# Altium project Horizontal New MC.PrjPcb
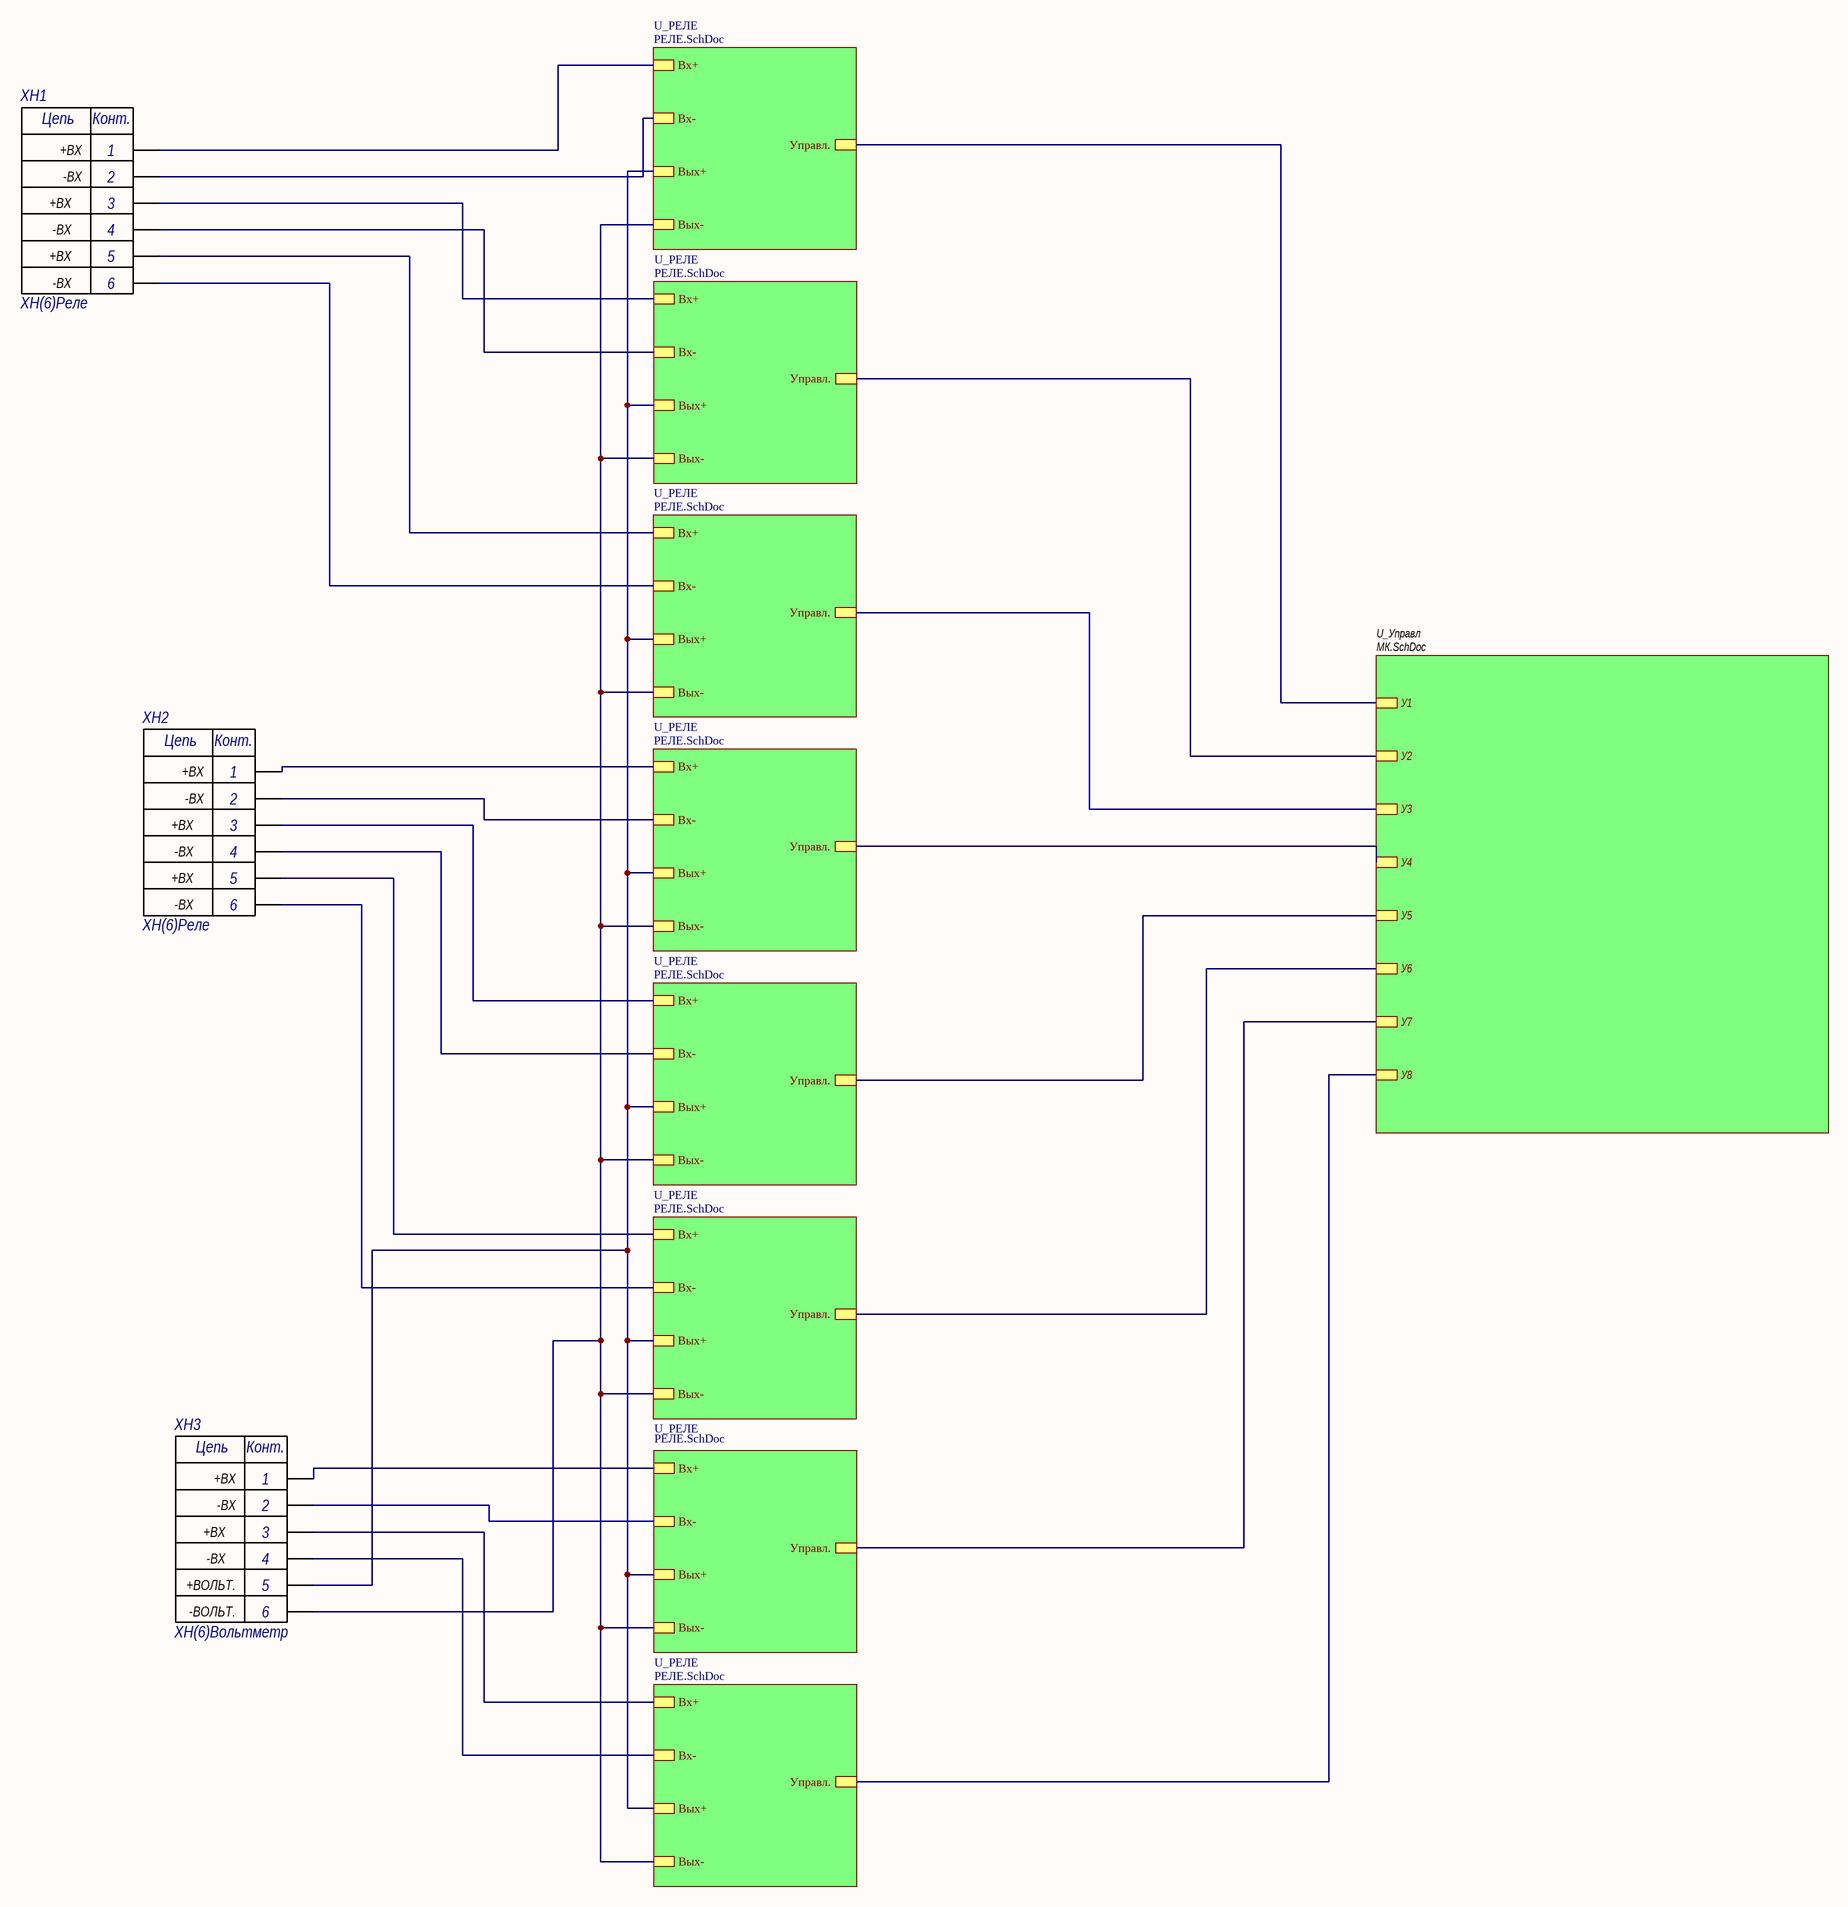
[diagram p0: СОЕД.SchDoc]
5 sheets, 175 parts. Net scope: hierarchical (ports join the sheet entries above them; power ports are global).
Board file: Horizontal Circuit Board.PcbDoc
Sheets:
  СОЕД.SchDoc
    U_РЕЛЕ = РЕЛЕ.SchDoc
    U_Управл = МК.SchDoc
      Y_СОГЛАСОВАНИЕ = СОГЛАСОВАНИЕ с мюксами.SchDoc
        Designator = ВХ Б (1-6).SchDoc
        Designator = ВХ Б (1-6).SchDoc
        Designator = ВХ Б (1-6).SchDoc
        Designator = ВХ Б (1-6).SchDoc
        Designator = ВХ Б (1-6).SchDoc
        Designator = ВХ Б (1-6).SchDoc
    U_РЕЛЕ = РЕЛЕ.SchDoc
    U_РЕЛЕ = РЕЛЕ.SchDoc
    U_РЕЛЕ = РЕЛЕ.SchDoc
    U_РЕЛЕ = РЕЛЕ.SchDoc
    U_РЕЛЕ = РЕЛЕ.SchDoc
    U_РЕЛЕ = РЕЛЕ.SchDoc
    U_РЕЛЕ = РЕЛЕ.SchDoc

## Sheet СОЕД.SchDoc
size A2; Organization: Altium Limited; Address1: L3, 12a Rodborough Rd; Address2: Frenchs Forest; Address3: NSW; Address4: Australia 2086; SheetNumber: 1; SheetTotal: 5

### Parts
XH1  ХH(6)Реле  [XH(6)]
XH2  ХH(6)Реле  [XH(6)]
XH3  ХH(6)Вольтметр  [XH(6)]

### Sub-sheets
U_РЕЛЕ = РЕЛЕ.SchDoc: Управл., Вх+, Вх-, Вых-, Вых+
U_РЕЛЕ = РЕЛЕ.SchDoc: Управл., Вх+, Вх-, Вых-, Вых+
U_РЕЛЕ = РЕЛЕ.SchDoc: Управл., Вх+, Вх-, Вых-, Вых+
U_РЕЛЕ = РЕЛЕ.SchDoc: Управл., Вх+, Вх-, Вых-, Вых+
U_РЕЛЕ = РЕЛЕ.SchDoc: Управл., Вх+, Вх-, Вых-, Вых+
U_РЕЛЕ = РЕЛЕ.SchDoc: Управл., Вх+, Вх-, Вых-, Вых+
U_РЕЛЕ = РЕЛЕ.SchDoc: Управл., Вх+, Вх-, Вых-, Вых+
U_РЕЛЕ = РЕЛЕ.SchDoc: Управл., Вх+, Вх-, Вых-, Вых+
U_Управл = МК.SchDoc: У8, У7, У2, У6, У5, У3, У1, У4

### Nets
NetDD1_24: sheet U_РЕЛЕ/Управл., sheet U_Управл/У1
NetDD1_25: sheet U_Управл/У2, sheet U_РЕЛЕ/Управл.
NetDD1_26: sheet U_Управл/У3, sheet U_РЕЛЕ/Управл.
NetDD1_29: sheet U_Управл/У4, sheet U_РЕЛЕ/Управл.
NetDD1_30: sheet U_Управл/У5, sheet U_РЕЛЕ/Управл.
NetDD1_31: sheet U_Управл/У6, sheet U_РЕЛЕ/Управл.
NetDD1_32: sheet U_Управл/У7, sheet U_РЕЛЕ/Управл.
NetDD1_67: sheet U_Управл/У8, sheet U_РЕЛЕ/Управл.
NetK1_U_РЕЛЕ#1_3: XH1.2(-ВХ) ; sheet U_РЕЛЕ/Вх-
NetK1_U_РЕЛЕ#1_4: XH3.6(-ВОЛЬТ.) ; sheet U_РЕЛЕ/Вых-, sheet U_РЕЛЕ/Вых-, sheet U_РЕЛЕ/Вых-, sheet U_РЕЛЕ/Вых-, sheet U_РЕЛЕ/Вых-, sheet U_РЕЛЕ/Вых-, sheet U_РЕЛЕ/Вых-, sheet U_РЕЛЕ/Вых-
NetK1_U_РЕЛЕ#1_5: XH3.5(+ВОЛЬТ.) ; sheet U_РЕЛЕ/Вых+, sheet U_РЕЛЕ/Вых+, sheet U_РЕЛЕ/Вых+, sheet U_РЕЛЕ/Вых+, sheet U_РЕЛЕ/Вых+, sheet U_РЕЛЕ/Вых+, sheet U_РЕЛЕ/Вых+, sheet U_РЕЛЕ/Вых+
NetK1_U_РЕЛЕ#1_6: XH1.1(+ВХ) ; sheet U_РЕЛЕ/Вх+
NetK1_U_РЕЛЕ#2_3: XH1.4(-ВХ) ; sheet U_РЕЛЕ/Вх-
NetK1_U_РЕЛЕ#2_6: XH1.3(+ВХ) ; sheet U_РЕЛЕ/Вх+
NetK1_U_РЕЛЕ#3_3: XH1.6(-ВХ) ; sheet U_РЕЛЕ/Вх-
NetK1_U_РЕЛЕ#3_6: XH1.5(+ВХ) ; sheet U_РЕЛЕ/Вх+
NetK1_U_РЕЛЕ#4_3: XH2.2(-ВХ) ; sheet U_РЕЛЕ/Вх-
NetK1_U_РЕЛЕ#4_6: XH2.1(+ВХ) ; sheet U_РЕЛЕ/Вх+
NetK1_U_РЕЛЕ#5_3: XH2.4(-ВХ) ; sheet U_РЕЛЕ/Вх-
NetK1_U_РЕЛЕ#5_6: XH2.3(+ВХ) ; sheet U_РЕЛЕ/Вх+
NetK1_U_РЕЛЕ#6_3: XH2.6(-ВХ) ; sheet U_РЕЛЕ/Вх-
NetK1_U_РЕЛЕ#6_6: XH2.5(+ВХ) ; sheet U_РЕЛЕ/Вх+
NetK1_U_РЕЛЕ#7_3: XH3.2(-ВХ) ; sheet U_РЕЛЕ/Вх-
NetK1_U_РЕЛЕ#7_6: XH3.1(+ВХ) ; sheet U_РЕЛЕ/Вх+
NetK1_U_РЕЛЕ#8_3: XH3.4(-ВХ) ; sheet U_РЕЛЕ/Вх-
NetK1_U_РЕЛЕ#8_6: XH3.3(+ВХ) ; sheet U_РЕЛЕ/Вх+

### Notes on the sheet
- Title
- Size:
- Date:
- File:
- A2
- Number:
- Time:
- Revision:
- Sheet
- of
- (in symbol ХH(6)Вольтметр) Цепь; Конт.
- (in symbol ХH(6)Реле) Цепь; Конт.

## Sheet РЕЛЕ.SchDoc
size A4; Organization: Altium Limited; Address1: L3, 12a Rodborough Rd; Address2: Frenchs Forest; Address3: NSW; Address4: Australia 2086; SheetNumber: 5; SheetTotal: 5
Used 8 times, as channels U_РЕЛЕ, U_РЕЛЕ, U_РЕЛЕ, U_РЕЛЕ, U_РЕЛЕ, U_РЕЛЕ, U_РЕЛЕ, U_РЕЛЕ. Parts and nets are listed once, with the designators drawn on the sheet.
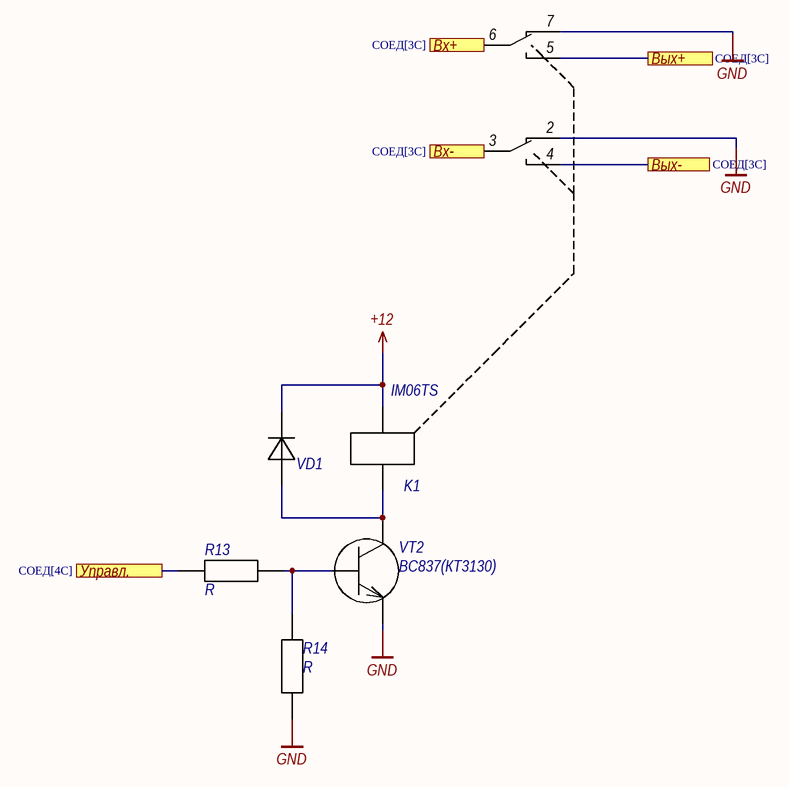
[diagram p1: РЕЛЕ.SchDoc]

### Parts
K1  IM06TS  [IM06TS]
R13  R  [R]
R14  R  [R]
VD1  SS14  [SS14]  (value not drawn)
VT2  BC837(КТ3130)  [BC847(IRLML6402)]

### Ports
Вх+ (see СОЕД[3C]), Вх- (see СОЕД[3C]), Вых+ (see СОЕД[3C]), Вых- (see СОЕД[3C]), Управл. (see СОЕД[4C])

### Nets
+12: K1.1 VD1.1
GND: K1.2 K1.7 R14.1 VT2.2
Вх+: K1.6 ; port Вх+
Вх-: K1.3 ; port Вх-
Вых+: K1.5 ; port Вых+
Вых-: K1.4 ; port Вых-
Управл.: R13.1 ; port Управл.
NetK1_8: K1.8 VD1.2 VT2.3
NetR13_2: R13.2 R14.2 VT2.1

### Channels
U_РЕЛЕ: designators end in _U_РЕЛЕ#1; ports Вх+=NetK1_U_РЕЛЕ#1_6 Вх-=NetK1_U_РЕЛЕ#1_3 Вых+=NetK1_U_РЕЛЕ#1_5 Вых-=NetK1_U_РЕЛЕ#1_4 Управл.=NetDD1_24
U_РЕЛЕ: designators end in _U_РЕЛЕ#2; ports Вх+=NetK1_U_РЕЛЕ#2_6 Вх-=NetK1_U_РЕЛЕ#2_3 Вых+=NetK1_U_РЕЛЕ#1_5 Вых-=NetK1_U_РЕЛЕ#1_4 Управл.=NetDD1_25
U_РЕЛЕ: designators end in _U_РЕЛЕ#3; ports Вх+=NetK1_U_РЕЛЕ#3_6 Вх-=NetK1_U_РЕЛЕ#3_3 Вых+=NetK1_U_РЕЛЕ#1_5 Вых-=NetK1_U_РЕЛЕ#1_4 Управл.=NetDD1_26
U_РЕЛЕ: designators end in _U_РЕЛЕ#4; ports Вх+=NetK1_U_РЕЛЕ#4_6 Вх-=NetK1_U_РЕЛЕ#4_3 Вых+=NetK1_U_РЕЛЕ#1_5 Вых-=NetK1_U_РЕЛЕ#1_4 Управл.=NetDD1_29
U_РЕЛЕ: designators end in _U_РЕЛЕ#5; ports Вх+=NetK1_U_РЕЛЕ#5_6 Вх-=NetK1_U_РЕЛЕ#5_3 Вых+=NetK1_U_РЕЛЕ#1_5 Вых-=NetK1_U_РЕЛЕ#1_4 Управл.=NetDD1_30
U_РЕЛЕ: designators end in _U_РЕЛЕ#6; ports Вх+=NetK1_U_РЕЛЕ#6_6 Вх-=NetK1_U_РЕЛЕ#6_3 Вых+=NetK1_U_РЕЛЕ#1_5 Вых-=NetK1_U_РЕЛЕ#1_4 Управл.=NetDD1_31
U_РЕЛЕ: designators end in _U_РЕЛЕ#7; ports Вх+=NetK1_U_РЕЛЕ#7_6 Вх-=NetK1_U_РЕЛЕ#7_3 Вых+=NetK1_U_РЕЛЕ#1_5 Вых-=NetK1_U_РЕЛЕ#1_4 Управл.=NetDD1_32
U_РЕЛЕ: designators end in _U_РЕЛЕ#8; ports Вх+=NetK1_U_РЕЛЕ#8_6 Вх-=NetK1_U_РЕЛЕ#8_3 Вых+=NetK1_U_РЕЛЕ#1_5 Вых-=NetK1_U_РЕЛЕ#1_4 Управл.=NetDD1_67

### Notes on the sheet
- Title
- Size:
- Date:
- A4
- Number:
- Time:
- Revision:
- Sheet
- of
- File:

### Library data of the parts
VT2 = BC837(КТ3130): Транзистор

## Sheet МК.SchDoc
size 840 x 594 mm; SheetNumber: 2; SheetTotal: 5
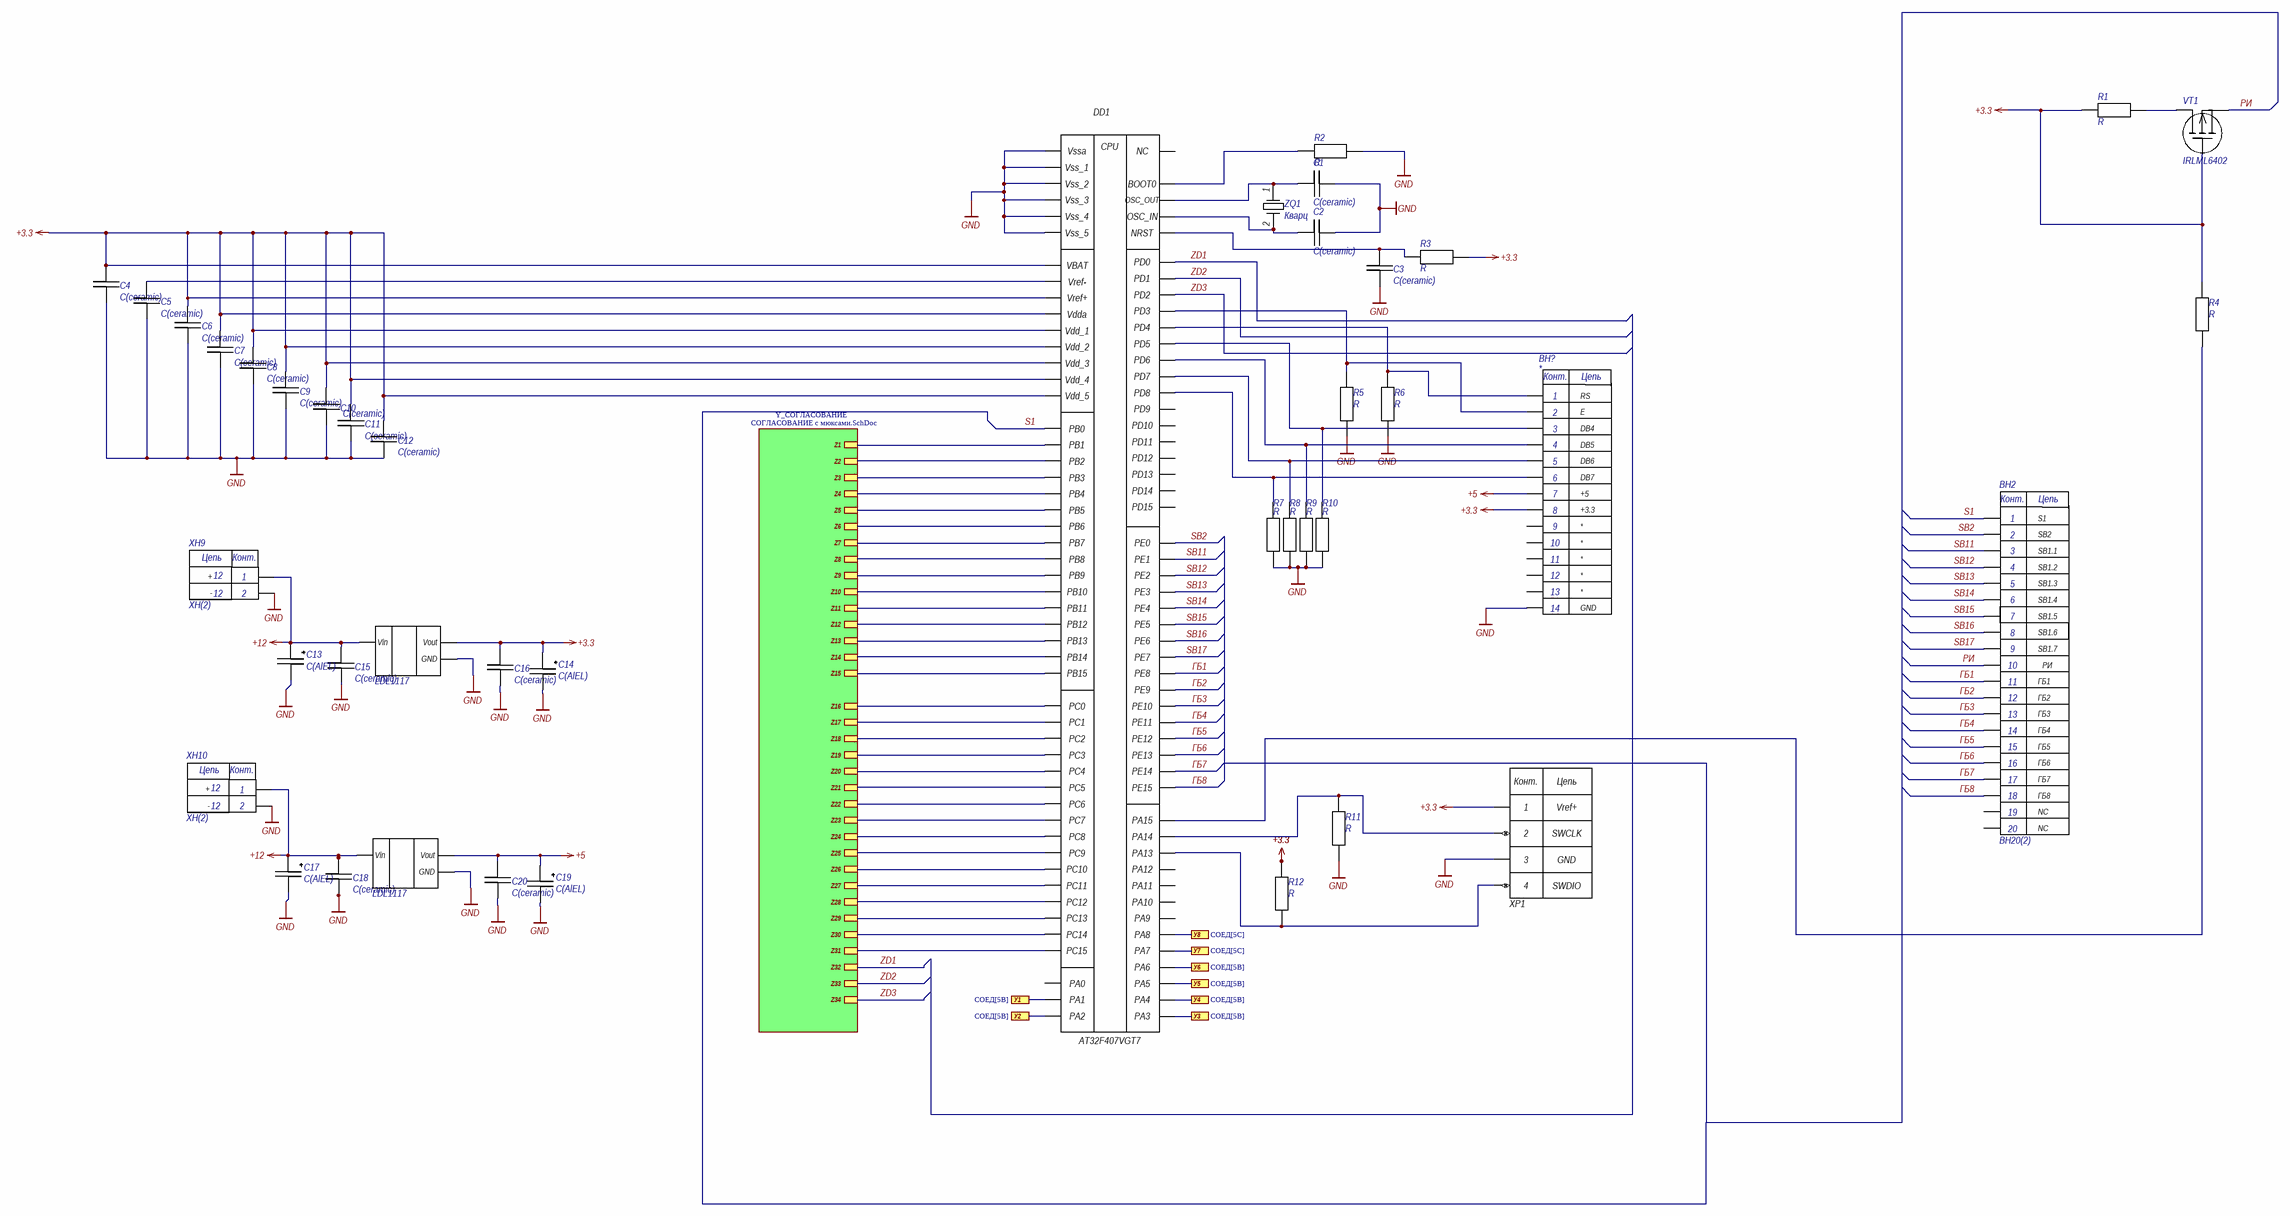
[diagram p2: МК.SchDoc]

### Parts
BH2  BH20(2)  [IDC20]
BH?  *  [BH-14 (DS1013-14S) (IDC-14MS)]
C1  C(ceramic)  [C(ceramic)]
C2  C(ceramic)  [C(ceramic)]
C3  C(ceramic)  [C(ceramic)]
C4  C(ceramic)  [C(ceramic)]
C5  C(ceramic)  [C(ceramic)]
C6  C(ceramic)  [C(ceramic)]
C7  C(ceramic)  [C(ceramic)]
C8  C(ceramic)  [C(ceramic)]
C9  C(ceramic)  [C(ceramic)]
C10  C(ceramic)  [C(ceramic)]
C11  C(ceramic)  [C(ceramic)]
C12  C(ceramic)  [C(ceramic)]
C13  C(AlEL)  [C(AlEL)]
C14  C(AlEL)  [C(AlEL)]
C15  C(ceramic)  [C(ceramic)]
C16  C(ceramic)  [C(ceramic)]
C17  C(AlEL)  [C(AlEL)]
C18  C(ceramic)  [C(ceramic)]
C19  C(AlEL)  [C(AlEL)]
C20  C(ceramic)  [C(ceramic)]
DD1  AT32F407VGT7  [Микроконтроллер AT32F407VGT7_LQFP-100]
DD2  LDL1117  [LDL1117]
DD3  LDL1117  [LDL1117]
R1  R  [R]
R2  R  [R]
R3  R  [R]
R4  R  [R]
R5  R  [R]
R6  R  [R]
R7  R  [R]
R8  R  [R]
R9  R  [R]
R10  R  [R]
R11  R  [R]
R12  R  [R]
VT1  IRLML6402  [BC847(IRLML6402)]
XH9  ХН(2)  [ХН(2)]
XH10  ХН(2)  [ХН(2)]
XP1  Обозначение при заказе  [PLS-4]  (value not drawn)
ZQ1  Кварц  [KX-38 32.768 KHZ]

### Sub-sheets
Y_СОГЛАСОВАНИЕ = СОГЛАСОВАНИЕ с мюксами.SchDoc: Z1, Z2, Z3, Z4, Z5, Z6, Z7, Z8, Z9, Z10, Z11, Z12, Z13, Z14, Z15, Z16, Z17, Z18, Z19, Z20, Z21, Z22, Z23, Z24, Z25, Z26, Z27, Z28, Z29, Z30, Z31, Z32, Z33, Z34

### Ports
У1 (see СОЕД[5B]), У2 (see СОЕД[5B]), У3 (see СОЕД[5B]), У4 (see СОЕД[5B]), У5 (see СОЕД[5B]), У6 (see СОЕД[5B]), У7 (see СОЕД[5C]), У8 (see СОЕД[5C])

### Nets
+3.3: BH?.8(+3.3) C4.2 C6.2 C7.2 C8.2 C9.2 C10.2 C11.2 C12.2 C14.1 C16.2 DD1.6(VBAT) DD1.11(Vdd_5) DD1.21(Vref+) DD1.22(Vdda) DD1.28(Vdd_4) DD1.50(Vdd_1) DD1.75(Vdd_2) DD1.100(Vdd_3) DD2.2(Vout) R1.2 R3.1 R4.2 R12.1 VT1.1 XP1.1(Uпит)
+5: BH?.7(+5) C19.1 C20.2 DD3.2(Vout)
+12: C13.1 C15.2 C17.1 C18.2 DD2.3(Vin) DD3.3(Vin) XH9.1(+) XH10.1(+)
GND: BH?.14(GND) C1.2 C2.2 C3.1 C4.1 C5.1 C6.1 C7.1 C8.1 C9.1 C10.1 C11.1 C12.1 C13.2 C14.2 C15.1 C16.1 C17.2 C18.1 C19.2 C20.1 DD1.10(Vss_5) DD1.19(Vssa) DD1.27(Vss_4) DD1.49(Vss_1) DD1.74(Vss_2) DD1.99(Vss_3) DD2.1(GND) DD3.1(GND) R2.2 R5.1 R6.1 R7.2 R8.2 R9.2 R10.2 R11.1 XH9.2(-) XH10.2(-) XP1.3(GND)
S1: BH2.1(S1) DD1.35(PB0)
SB2: BH2.2(SB2) DD1.97(PE0)
SB11: BH2.3(SB1.1) DD1.98(PE1)
SB12: BH2.4(SB1.2) DD1.1(PE2)
SB13: BH2.5(SB1.3) DD1.2(PE3)
SB14: BH2.6(SB1.4) DD1.3(PE4)
SB15: BH2.7(SB1.5) DD1.4(PE5)
SB16: BH2.8(SB1.6) DD1.5(PE6)
SB17: BH2.9(SB1.7) DD1.38(PE7)
ZD1: DD1.81(PD0) ; sheet Y_СОГЛАСОВАНИЕ/Z32
ZD2: DD1.82(PD1) ; sheet Y_СОГЛАСОВАНИЕ/Z33
ZD3: DD1.83(PD2) ; sheet Y_СОГЛАСОВАНИЕ/Z34
ГБ1: BH2.11(ГБ1) DD1.39(PE8)
ГБ2: BH2.12(ГБ2) DD1.40(PE9)
ГБ3: BH2.13(ГБ3) DD1.41(PE10)
ГБ4: BH2.14(ГБ4) DD1.42(PE11)
ГБ5: BH2.15(ГБ5) DD1.43(PE12)
ГБ6: BH2.16(ГБ6) DD1.44(PE13)
ГБ7: BH2.17(ГБ7) DD1.45(PE14)
ГБ8: BH2.18(ГБ8) DD1.46(PE15)
РИ: BH2.10(РИ) VT1.2
NetBH?_1: BH?.1(RS) DD1.85(PD4) R6.2
NetBH?_2: BH?.2(E) DD1.84(PD3) R5.2
NetBH?_3: BH?.3(DB4) DD1.86(PD5) R10.1
NetBH?_4: BH?.4(DB5) DD1.87(PD6) R9.1
NetBH?_5: BH?.5(DB6) DD1.88(PD7) R8.1
NetBH?_6: BH?.6(DB7) DD1.55(PD8) R7.1
NetC1_1: C1.1 DD1.13(OSC_OUT) ZQ1.1
NetC2_1: C2.1 DD1.12(OSC_IN) ZQ1.2
NetC3_2: C3.2 DD1.14(NRST) R3.2
NetC5_2: C5.2 DD1.20(Vref-)
NetDD1_7: DD1.7(PC13) ; sheet Y_СОГЛАСОВАНИЕ/Z29
NetDD1_8: DD1.8(PC14) ; sheet Y_СОГЛАСОВАНИЕ/Z30
NetDD1_9: DD1.9(PC15) ; sheet Y_СОГЛАСОВАНИЕ/Z31
NetDD1_15: DD1.15(PC0) ; sheet Y_СОГЛАСОВАНИЕ/Z16
NetDD1_16: DD1.16(PC1) ; sheet Y_СОГЛАСОВАНИЕ/Z17
NetDD1_17: DD1.17(PC2) ; sheet Y_СОГЛАСОВАНИЕ/Z18
NetDD1_18: DD1.18(PC3) ; sheet Y_СОГЛАСОВАНИЕ/Z19
NetDD1_24: DD1.24(PA1) ; port У1
NetDD1_25: DD1.25(PA2) ; port У2
NetDD1_26: DD1.26(PA3) ; port У3
NetDD1_29: DD1.29(PA4) ; port У4
NetDD1_30: DD1.30(PA5) ; port У5
NetDD1_31: DD1.31(PA6) ; port У6
NetDD1_32: DD1.32(PA7) ; port У7
NetDD1_33: DD1.33(PC4) ; sheet Y_СОГЛАСОВАНИЕ/Z20
NetDD1_34: DD1.34(PC4) ; sheet Y_СОГЛАСОВАНИЕ/Z21
NetDD1_36: DD1.36(PB1) ; sheet Y_СОГЛАСОВАНИЕ/Z1
NetDD1_37: DD1.37(PB2) ; sheet Y_СОГЛАСОВАНИЕ/Z2
NetDD1_47: DD1.47(PB10) ; sheet Y_СОГЛАСОВАНИЕ/Z10
NetDD1_48: DD1.48(PB11) ; sheet Y_СОГЛАСОВАНИЕ/Z11
NetDD1_51: DD1.51(PB12) ; sheet Y_СОГЛАСОВАНИЕ/Z12
NetDD1_52: DD1.52(PB13) ; sheet Y_СОГЛАСОВАНИЕ/Z13
NetDD1_53: DD1.53(PB14) ; sheet Y_СОГЛАСОВАНИЕ/Z14
NetDD1_54: DD1.54(PB15) ; sheet Y_СОГЛАСОВАНИЕ/Z15
NetDD1_63: DD1.63(PC6) ; sheet Y_СОГЛАСОВАНИЕ/Z22
NetDD1_64: DD1.64(PC7) ; sheet Y_СОГЛАСОВАНИЕ/Z23
NetDD1_65: DD1.65(PC8) ; sheet Y_СОГЛАСОВАНИЕ/Z24
NetDD1_66: DD1.66(PC9) ; sheet Y_СОГЛАСОВАНИЕ/Z25
NetDD1_67: DD1.67(PA8) ; port У8
NetDD1_72: DD1.72(PA13) R12.2 XP1.4(SWDIO)
NetDD1_76: DD1.76(PA14) R11.2 XP1.2(SWCLK)
NetDD1_77: DD1.77(PA15) R4.1
NetDD1_78: DD1.78(PC10) ; sheet Y_СОГЛАСОВАНИЕ/Z26
NetDD1_79: DD1.79(PC11) ; sheet Y_СОГЛАСОВАНИЕ/Z27
NetDD1_80: DD1.80(PC12) ; sheet Y_СОГЛАСОВАНИЕ/Z28
NetDD1_89: DD1.89(PB3) ; sheet Y_СОГЛАСОВАНИЕ/Z3
NetDD1_90: DD1.90(PB4) ; sheet Y_СОГЛАСОВАНИЕ/Z4
NetDD1_91: DD1.91(PB5) ; sheet Y_СОГЛАСОВАНИЕ/Z5
NetDD1_92: DD1.92(PB6) ; sheet Y_СОГЛАСОВАНИЕ/Z6
NetDD1_93: DD1.93(PB7) ; sheet Y_СОГЛАСОВАНИЕ/Z7
NetDD1_94: DD1.94(BOOT0) R2.1
NetDD1_95: DD1.95(PB8) ; sheet Y_СОГЛАСОВАНИЕ/Z8
NetDD1_96: DD1.96(PB9) ; sheet Y_СОГЛАСОВАНИЕ/Z9
NetR1_1: R1.1 VT1.3

Not connected (* = marked no-connect by the designer): BH2 19(NC) 20(NC); BH? 9(*) 10(*) 11(*) 12(*) 13(*); DD1 23(PA0) 56(PD9) 57(PD10) 58(PD11) 59(PD12) 60(PD13) 61(PD14) 62(PD15) 68(PA9) 69(PA10) 70(PA11) 71(PA12) 73(NC)

### Notes on the sheet
- 12
- Перв. примен.
- Справ. №
- Подп. дата
- Инв. № дубл.
- Взам. инв. №
- Подп. и дата
- Изм.
- Разраб.
- Лист
- № докум.
- Подп.
- Дата
- Лит.
- Масса
- Масштаб
- Пров.
- Т.контр.
- Листов
- Инв. № подл.
- Н.контр.
- Утв.
- ALTIUM GOSTBOM2.0 KEV
- Файл:
- Копировал
- Формат А1
- (in symbol AT32F407) CPU; PC5
- (in symbol BH14(3)) Конт.; Цепь
- (in symbol BH20(2)) Конт.; Цепь
- (in symbol PLS-4) Конт.; Цепь; Vref+
- (in symbol ХН(2)) Цепь; Конт.

### Library data of the parts
BH? = BH14(3)
C1-C12 C15 C16 C18 C20 = C(ceramic): SMD
C13 C14 C17 C19 = C(AlEL): Электролит
DD1 = AT32F407: МК
DD2 DD3 = LDL1117: Стабилизатор
R1-R12 = R: SMD
VT1 = IRLML6402: Транзистор
XP1 = PLS-4: Штырьки
ZQ1 = KX-38 32.768 KHZ

## Sheet СОГЛАСОВАНИЕ с мюксами.SchDoc
size 297 x 420 mm; Organization: Altium Limited; Address1: L3, 12a Rodborough Rd; Address2: Frenchs Forest; Address3: NSW; Address4: Australia 2086; SheetNumber: 3; SheetTotal: 5
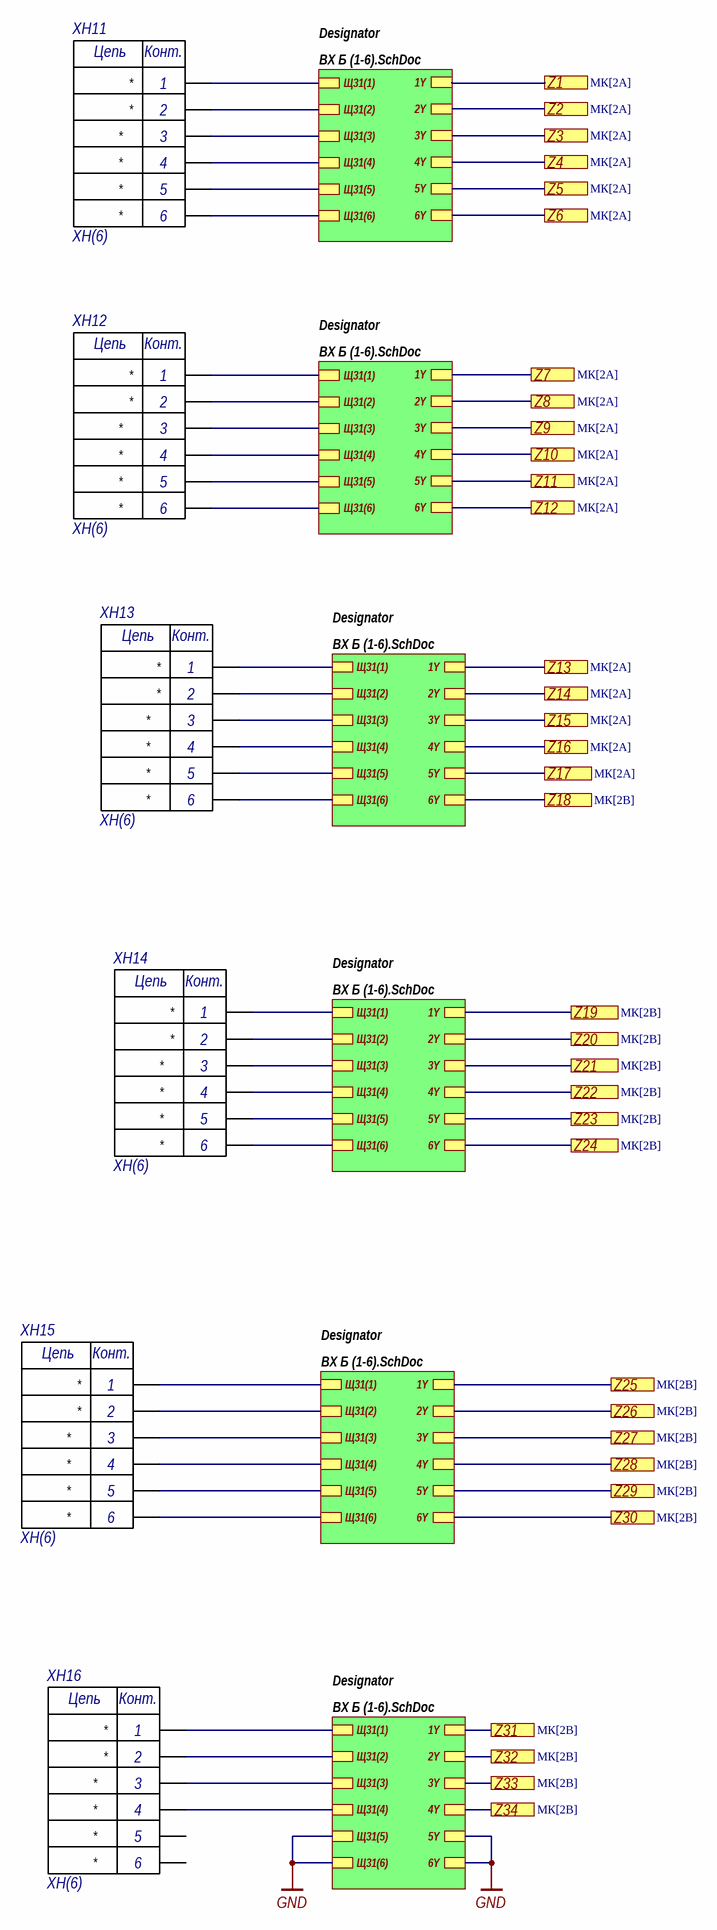
[diagram p3: СОГЛАСОВАНИЕ с мюксами.SchDoc]

### Parts
XH11  ХH(6)  [XH(6)]
XH12  ХH(6)  [XH(6)]
XH13  ХH(6)  [XH(6)]
XH14  ХH(6)  [XH(6)]
XH15  ХH(6)  [XH(6)]
XH16  ХH(6)  [XH(6)]

### Sub-sheets
Designator = ВХ Б (1-6).SchDoc: Щ31(1), Щ31(2), Щ31(3), Щ31(4), 2Y, 3Y, 4Y, 5Y, 6Y, Щ31(5), Щ31(6), 1Y
Designator = ВХ Б (1-6).SchDoc: Щ31(1), Щ31(2), Щ31(3), Щ31(4), 2Y, 3Y, 4Y, 5Y, 6Y, Щ31(5), Щ31(6), 1Y
Designator = ВХ Б (1-6).SchDoc: Щ31(1), Щ31(2), Щ31(3), Щ31(4), 2Y, 3Y, 4Y, 5Y, 6Y, Щ31(5), Щ31(6), 1Y
Designator = ВХ Б (1-6).SchDoc: Щ31(1), Щ31(2), Щ31(3), Щ31(4), 2Y, 3Y, 4Y, 5Y, 6Y, Щ31(5), Щ31(6), 1Y
Designator = ВХ Б (1-6).SchDoc: Щ31(1), Щ31(2), Щ31(3), Щ31(4), 2Y, 3Y, 4Y, 5Y, 6Y, Щ31(5), Щ31(6), 1Y
Designator = ВХ Б (1-6).SchDoc: Щ31(1), Щ31(2), Щ31(3), Щ31(4), 2Y, 3Y, 4Y, 5Y, 6Y, Щ31(5), Щ31(6), 1Y

### Ports
Z1 (see МК[2A]), Z2 (see МК[2A]), Z3 (see МК[2A]), Z4 (see МК[2A]), Z5 (see МК[2A]), Z6 (see МК[2A]), Z7 (see МК[2A]), Z8 (see МК[2A]), Z9 (see МК[2A]), Z10 (see МК[2A]), Z11 (see МК[2A]), Z12 (see МК[2A]), Z13 (see МК[2A]), Z14 (see МК[2A]), Z15 (see МК[2A]), Z16 (see МК[2A]), Z17 (see МК[2A]), Z18 (see МК[2B]), Z19 (see МК[2B]), Z20 (see МК[2B]), Z21 (see МК[2B]), Z22 (see МК[2B]), Z23 (see МК[2B]), Z24 (see МК[2B]), Z25 (see МК[2B]), Z26 (see МК[2B]), Z27 (see МК[2B]), Z28 (see МК[2B]), Z29 (see МК[2B]), Z30 (see МК[2B]), Z31 (see МК[2B]), Z32 (see МК[2B]), Z33 (see МК[2B]), Z34 (see МК[2B])

### Nets
GND: sheet Designator/5Y, sheet Designator/6Y, sheet Designator/Щ31(5), sheet Designator/Щ31(6)
ZD1: port Z32, sheet Designator/2Y
ZD2: port Z33, sheet Designator/3Y
ZD3: port Z34, sheet Designator/4Y
NetDD1_7: port Z29, sheet Designator/5Y
NetDD1_8: port Z30, sheet Designator/6Y
NetDD1_9: port Z31, sheet Designator/1Y
NetDD1_15: port Z16, sheet Designator/4Y
NetDD1_16: port Z17, sheet Designator/5Y
NetDD1_17: port Z18, sheet Designator/6Y
NetDD1_18: port Z19, sheet Designator/1Y
NetDD1_33: port Z20, sheet Designator/2Y
NetDD1_34: port Z21, sheet Designator/3Y
NetDD1_36: port Z1, sheet Designator/1Y
NetDD1_37: port Z2, sheet Designator/2Y
NetDD1_47: port Z10, sheet Designator/4Y
NetDD1_48: port Z11, sheet Designator/5Y
NetDD1_51: port Z12, sheet Designator/6Y
NetDD1_52: port Z13, sheet Designator/1Y
NetDD1_53: port Z14, sheet Designator/2Y
NetDD1_54: port Z15, sheet Designator/3Y
NetDD1_63: port Z22, sheet Designator/4Y
NetDD1_64: port Z23, sheet Designator/5Y
NetDD1_65: port Z24, sheet Designator/6Y
NetDD1_66: port Z25, sheet Designator/1Y
NetDD1_78: port Z26, sheet Designator/2Y
NetDD1_79: port Z27, sheet Designator/3Y
NetDD1_80: port Z28, sheet Designator/4Y
NetDD1_89: port Z3, sheet Designator/3Y
NetDD1_90: port Z4, sheet Designator/4Y
NetDD1_91: port Z5, sheet Designator/5Y
NetDD1_92: port Z6, sheet Designator/6Y
NetDD1_93: port Z7, sheet Designator/1Y
NetDD1_95: port Z8, sheet Designator/2Y
NetDD1_96: port Z9, sheet Designator/3Y
NetR15_U_Управл_Y_СОГЛАСОВАНИЕ_Designator#1_1: XH11.1 ; sheet Designator/Щ31(1)
NetR15_U_Управл_Y_СОГЛАСОВАНИЕ_Designator#2_1: XH12.1 ; sheet Designator/Щ31(1)
NetR15_U_Управл_Y_СОГЛАСОВАНИЕ_Designator#3_1: XH13.1 ; sheet Designator/Щ31(1)
NetR15_U_Управл_Y_СОГЛАСОВАНИЕ_Designator#4_1: XH14.1 ; sheet Designator/Щ31(1)
NetR15_U_Управл_Y_СОГЛАСОВАНИЕ_Designator#5_1: XH15.1 ; sheet Designator/Щ31(1)
NetR15_U_Управл_Y_СОГЛАСОВАНИЕ_Designator#6_1: XH16.1 ; sheet Designator/Щ31(1)
NetR16_U_Управл_Y_СОГЛАСОВАНИЕ_Designator#1_1: XH11.2 ; sheet Designator/Щ31(2)
NetR16_U_Управл_Y_СОГЛАСОВАНИЕ_Designator#2_1: XH12.2 ; sheet Designator/Щ31(2)
NetR16_U_Управл_Y_СОГЛАСОВАНИЕ_Designator#3_1: XH13.2 ; sheet Designator/Щ31(2)
NetR16_U_Управл_Y_СОГЛАСОВАНИЕ_Designator#4_1: XH14.2 ; sheet Designator/Щ31(2)
NetR16_U_Управл_Y_СОГЛАСОВАНИЕ_Designator#5_1: XH15.2 ; sheet Designator/Щ31(2)
NetR16_U_Управл_Y_СОГЛАСОВАНИЕ_Designator#6_1: XH16.2 ; sheet Designator/Щ31(2)
NetR17_U_Управл_Y_СОГЛАСОВАНИЕ_Designator#1_1: XH11.3 ; sheet Designator/Щ31(3)
NetR17_U_Управл_Y_СОГЛАСОВАНИЕ_Designator#2_1: XH12.3 ; sheet Designator/Щ31(3)
NetR17_U_Управл_Y_СОГЛАСОВАНИЕ_Designator#3_1: XH13.3 ; sheet Designator/Щ31(3)
NetR17_U_Управл_Y_СОГЛАСОВАНИЕ_Designator#4_1: XH14.3 ; sheet Designator/Щ31(3)
NetR17_U_Управл_Y_СОГЛАСОВАНИЕ_Designator#5_1: XH15.3 ; sheet Designator/Щ31(3)
NetR17_U_Управл_Y_СОГЛАСОВАНИЕ_Designator#6_1: XH16.3 ; sheet Designator/Щ31(3)
NetR18_U_Управл_Y_СОГЛАСОВАНИЕ_Designator#1_1: XH11.4 ; sheet Designator/Щ31(4)
NetR18_U_Управл_Y_СОГЛАСОВАНИЕ_Designator#2_1: XH12.4 ; sheet Designator/Щ31(4)
NetR18_U_Управл_Y_СОГЛАСОВАНИЕ_Designator#3_1: XH13.4 ; sheet Designator/Щ31(4)
NetR18_U_Управл_Y_СОГЛАСОВАНИЕ_Designator#4_1: XH14.4 ; sheet Designator/Щ31(4)
NetR18_U_Управл_Y_СОГЛАСОВАНИЕ_Designator#5_1: XH15.4 ; sheet Designator/Щ31(4)
NetR18_U_Управл_Y_СОГЛАСОВАНИЕ_Designator#6_1: XH16.4 ; sheet Designator/Щ31(4)
NetR19_U_Управл_Y_СОГЛАСОВАНИЕ_Designator#1_1: XH11.5 ; sheet Designator/Щ31(5)
NetR19_U_Управл_Y_СОГЛАСОВАНИЕ_Designator#2_1: XH12.5 ; sheet Designator/Щ31(5)
NetR19_U_Управл_Y_СОГЛАСОВАНИЕ_Designator#3_1: XH13.5 ; sheet Designator/Щ31(5)
NetR19_U_Управл_Y_СОГЛАСОВАНИЕ_Designator#4_1: XH14.5 ; sheet Designator/Щ31(5)
NetR19_U_Управл_Y_СОГЛАСОВАНИЕ_Designator#5_1: XH15.5 ; sheet Designator/Щ31(5)
NetR20_U_Управл_Y_СОГЛАСОВАНИЕ_Designator#1_1: XH11.6 ; sheet Designator/Щ31(6)
NetR20_U_Управл_Y_СОГЛАСОВАНИЕ_Designator#2_1: XH12.6 ; sheet Designator/Щ31(6)
NetR20_U_Управл_Y_СОГЛАСОВАНИЕ_Designator#3_1: XH13.6 ; sheet Designator/Щ31(6)
NetR20_U_Управл_Y_СОГЛАСОВАНИЕ_Designator#4_1: XH14.6 ; sheet Designator/Щ31(6)
NetR20_U_Управл_Y_СОГЛАСОВАНИЕ_Designator#5_1: XH15.6 ; sheet Designator/Щ31(6)

Not connected (* = marked no-connect by the designer): XH16 5(*) 6(*)

### Notes on the sheet
- Подп. дата
- Инв. № дубл.
- Взам. инв. №
- Подп. и дата
- Инв. № подл.
- Изм.
- Лист
- № докум.
- Подп.
- Дата
- ALTIUM GOSTBOM2.0 KEV
- Файл:
- Копировал
- Формат А3
- (in symbol ХH(6)) Цепь; Конт.

## Sheet ВХ Б (1-6).SchDoc
size A3; Organization: Altium Limited; Address1: L3, 12a Rodborough Rd; Address2: Frenchs Forest; Address3: NSW; Address4: Australia 2086; SheetNumber: 4; SheetTotal: 5
Used 6 times, as channels U_Управл/Y_СОГЛАСОВАНИЕ/Designator, U_Управл/Y_СОГЛАСОВАНИЕ/Designator, U_Управл/Y_СОГЛАСОВАНИЕ/Designator, U_Управл/Y_СОГЛАСОВАНИЕ/Designator, U_Управл/Y_СОГЛАСОВАНИЕ/Designator, U_Управл/Y_СОГЛАСОВАНИЕ/Designator. Parts and nets are listed once, with the designators drawn on the sheet.
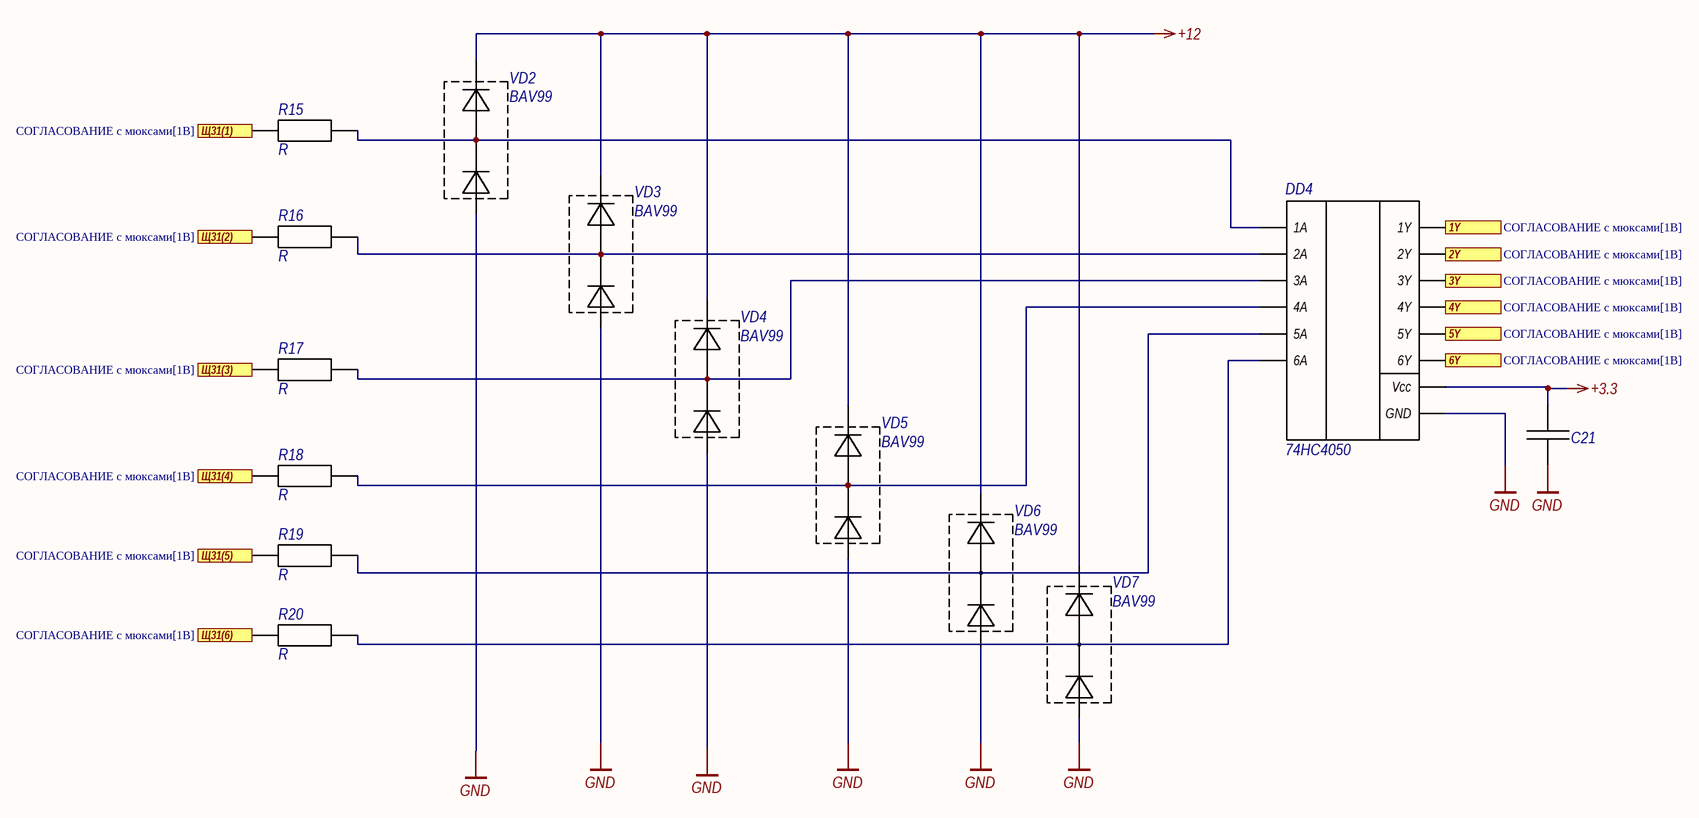
[diagram p4: ВХ Б (1-6).SchDoc]

### Parts
C21  C(ceramic)  [C(ceramic)]  (value not drawn)
DD4  74HC4050  [74HC4050(51)]
R15  R  [R]
R16  R  [R]
R17  R  [R]
R18  R  [R]
R19  R  [R]
R20  R  [R]
VD2  BAV99  [BAV99]
VD3  BAV99  [BAV99]
VD4  BAV99  [BAV99]
VD5  BAV99  [BAV99]
VD6  BAV99  [BAV99]
VD7  BAV99  [BAV99]

### Ports
1Y (see СОГЛАСОВАНИЕ с мюксами[1B]), 2Y (see СОГЛАСОВАНИЕ с мюксами[1B]), 3Y (see СОГЛАСОВАНИЕ с мюксами[1B]), 4Y (see СОГЛАСОВАНИЕ с мюксами[1B]), 5Y (see СОГЛАСОВАНИЕ с мюксами[1B]), 6Y (see СОГЛАСОВАНИЕ с мюксами[1B]), Щ31(1) (see СОГЛАСОВАНИЕ с мюксами[1B]), Щ31(2) (see СОГЛАСОВАНИЕ с мюксами[1B]), Щ31(3) (see СОГЛАСОВАНИЕ с мюксами[1B]), Щ31(4) (see СОГЛАСОВАНИЕ с мюксами[1B]), Щ31(5) (see СОГЛАСОВАНИЕ с мюксами[1B]), Щ31(6) (see СОГЛАСОВАНИЕ с мюксами[1B])

### Nets
+3.3: C21.1 DD4.1(Vcc)
+12: VD2.2 VD3.2 VD4.2 VD5.2 VD6.2 VD7.2
GND: C21.2 DD4.8(GND) VD2.1 VD3.1 VD4.1 VD5.1 VD6.1 VD7.1
1Y: DD4.2(1Y) ; port 1Y
2Y: DD4.4(2Y) ; port 2Y
3Y: DD4.6(3Y) ; port 3Y
4Y: DD4.10(4Y) ; port 4Y
5Y: DD4.12(5Y) ; port 5Y
6Y: DD4.15(6Y) ; port 6Y
Щ31(1): R15.1 ; port Щ31(1)
Щ31(2): R16.1 ; port Щ31(2)
Щ31(3): R17.1 ; port Щ31(3)
Щ31(4): R18.1 ; port Щ31(4)
Щ31(5): R19.1 ; port Щ31(5)
Щ31(6): R20.1 ; port Щ31(6)
NetDD4_3: DD4.3(1A) R15.2 VD2.3
NetDD4_5: DD4.5(2A) R16.2 VD3.3
NetDD4_7: DD4.7(3A) R17.2 VD4.3
NetDD4_9: DD4.9(4A) R18.2 VD5.3
NetDD4_11: DD4.11(5A) R19.2 VD6.3
NetDD4_14: DD4.14(6A) R20.2 VD7.3

### Channels
U_Управл/Y_СОГЛАСОВАНИЕ/Designator: designators end in _U_Управл_Y_СОГЛАСОВАНИЕ_Designator#1; ports 1Y=NetDD1_36 2Y=NetDD1_37 3Y=NetDD1_89 4Y=NetDD1_90 5Y=NetDD1_91 6Y=NetDD1_92 Щ31(1)=NetR15_U_Управл_Y_СОГЛАСОВАНИЕ_Designator#1_1 Щ31(2)=NetR16_U_Управл_Y_СОГЛАСОВАНИЕ_Designator#1_1 Щ31(3)=NetR17_U_Управл_Y_СОГЛАСОВАНИЕ_Designator#1_1 Щ31(4)=NetR18_U_Управл_Y_СОГЛАСОВАНИЕ_Designator#1_1 Щ31(5)=NetR19_U_Управл_Y_СОГЛАСОВАНИЕ_Designator#1_1 Щ31(6)=NetR20_U_Управл_Y_СОГЛАСОВАНИЕ_Designator#1_1
U_Управл/Y_СОГЛАСОВАНИЕ/Designator: designators end in _U_Управл_Y_СОГЛАСОВАНИЕ_Designator#2; ports 1Y=NetDD1_93 2Y=NetDD1_95 3Y=NetDD1_96 4Y=NetDD1_47 5Y=NetDD1_48 6Y=NetDD1_51 Щ31(1)=NetR15_U_Управл_Y_СОГЛАСОВАНИЕ_Designator#2_1 Щ31(2)=NetR16_U_Управл_Y_СОГЛАСОВАНИЕ_Designator#2_1 Щ31(3)=NetR17_U_Управл_Y_СОГЛАСОВАНИЕ_Designator#2_1 Щ31(4)=NetR18_U_Управл_Y_СОГЛАСОВАНИЕ_Designator#2_1 Щ31(5)=NetR19_U_Управл_Y_СОГЛАСОВАНИЕ_Designator#2_1 Щ31(6)=NetR20_U_Управл_Y_СОГЛАСОВАНИЕ_Designator#2_1
U_Управл/Y_СОГЛАСОВАНИЕ/Designator: designators end in _U_Управл_Y_СОГЛАСОВАНИЕ_Designator#3; ports 1Y=NetDD1_52 2Y=NetDD1_53 3Y=NetDD1_54 4Y=NetDD1_15 5Y=NetDD1_16 6Y=NetDD1_17 Щ31(1)=NetR15_U_Управл_Y_СОГЛАСОВАНИЕ_Designator#3_1 Щ31(2)=NetR16_U_Управл_Y_СОГЛАСОВАНИЕ_Designator#3_1 Щ31(3)=NetR17_U_Управл_Y_СОГЛАСОВАНИЕ_Designator#3_1 Щ31(4)=NetR18_U_Управл_Y_СОГЛАСОВАНИЕ_Designator#3_1 Щ31(5)=NetR19_U_Управл_Y_СОГЛАСОВАНИЕ_Designator#3_1 Щ31(6)=NetR20_U_Управл_Y_СОГЛАСОВАНИЕ_Designator#3_1
U_Управл/Y_СОГЛАСОВАНИЕ/Designator: designators end in _U_Управл_Y_СОГЛАСОВАНИЕ_Designator#4; ports 1Y=NetDD1_18 2Y=NetDD1_33 3Y=NetDD1_34 4Y=NetDD1_63 5Y=NetDD1_64 6Y=NetDD1_65 Щ31(1)=NetR15_U_Управл_Y_СОГЛАСОВАНИЕ_Designator#4_1 Щ31(2)=NetR16_U_Управл_Y_СОГЛАСОВАНИЕ_Designator#4_1 Щ31(3)=NetR17_U_Управл_Y_СОГЛАСОВАНИЕ_Designator#4_1 Щ31(4)=NetR18_U_Управл_Y_СОГЛАСОВАНИЕ_Designator#4_1 Щ31(5)=NetR19_U_Управл_Y_СОГЛАСОВАНИЕ_Designator#4_1 Щ31(6)=NetR20_U_Управл_Y_СОГЛАСОВАНИЕ_Designator#4_1
U_Управл/Y_СОГЛАСОВАНИЕ/Designator: designators end in _U_Управл_Y_СОГЛАСОВАНИЕ_Designator#5; ports 1Y=NetDD1_66 2Y=NetDD1_78 3Y=NetDD1_79 4Y=NetDD1_80 5Y=NetDD1_7 6Y=NetDD1_8 Щ31(1)=NetR15_U_Управл_Y_СОГЛАСОВАНИЕ_Designator#5_1 Щ31(2)=NetR16_U_Управл_Y_СОГЛАСОВАНИЕ_Designator#5_1 Щ31(3)=NetR17_U_Управл_Y_СОГЛАСОВАНИЕ_Designator#5_1 Щ31(4)=NetR18_U_Управл_Y_СОГЛАСОВАНИЕ_Designator#5_1 Щ31(5)=NetR19_U_Управл_Y_СОГЛАСОВАНИЕ_Designator#5_1 Щ31(6)=NetR20_U_Управл_Y_СОГЛАСОВАНИЕ_Designator#5_1
U_Управл/Y_СОГЛАСОВАНИЕ/Designator: designators end in _U_Управл_Y_СОГЛАСОВАНИЕ_Designator#6; ports 1Y=NetDD1_9 2Y=ZD1 3Y=ZD2 4Y=ZD3 5Y=GND 6Y=GND Щ31(1)=NetR15_U_Управл_Y_СОГЛАСОВАНИЕ_Designator#6_1 Щ31(2)=NetR16_U_Управл_Y_СОГЛАСОВАНИЕ_Designator#6_1 Щ31(3)=NetR17_U_Управл_Y_СОГЛАСОВАНИЕ_Designator#6_1 Щ31(4)=NetR18_U_Управл_Y_СОГЛАСОВАНИЕ_Designator#6_1 Щ31(5)=GND Щ31(6)=GND

### Notes on the sheet
- Title
- Size:
- Date:
- A3
- Number:
- Time:
- Revision:
- Sheet
- of
- File:

## Nets that join several sheets
+3.3: МК (26 pins), U_Управл/Y_СОГЛАСОВАНИЕ/Designator (C21_U_Управл_Y_СОГЛАСОВАНИЕ_Designator#1.1 DD4_U_Управл_Y_СОГЛАСОВАНИЕ_Designator#1.1), U_Управл/Y_СОГЛАСОВАНИЕ/Designator (C21_U_Управл_Y_СОГЛАСОВАНИЕ_Designator#2.1 DD4_U_Управл_Y_СОГЛАСОВАНИЕ_Designator#2.1), U_Управл/Y_СОГЛАСОВАНИЕ/Designator (C21_U_Управл_Y_СОГЛАСОВАНИЕ_Designator#3.1 DD4_U_Управл_Y_СОГЛАСОВАНИЕ_Designator#3.1), U_Управл/Y_СОГЛАСОВАНИЕ/Designator (C21_U_Управл_Y_СОГЛАСОВАНИЕ_Designator#4.1 DD4_U_Управл_Y_СОГЛАСОВАНИЕ_Designator#4.1), U_Управл/Y_СОГЛАСОВАНИЕ/Designator (C21_U_Управл_Y_СОГЛАСОВАНИЕ_Designator#5.1 DD4_U_Управл_Y_СОГЛАСОВАНИЕ_Designator#5.1), U_Управл/Y_СОГЛАСОВАНИЕ/Designator (C21_U_Управл_Y_СОГЛАСОВАНИЕ_Designator#6.1 DD4_U_Управл_Y_СОГЛАСОВАНИЕ_Designator#6.1)
+12: U_РЕЛЕ (K1_U_РЕЛЕ#1.1 VD1_U_РЕЛЕ#1.1), МК (8 pins), U_Управл/Y_СОГЛАСОВАНИЕ/Designator (6 pins), U_Управл/Y_СОГЛАСОВАНИЕ/Designator (6 pins), U_Управл/Y_СОГЛАСОВАНИЕ/Designator (6 pins), U_Управл/Y_СОГЛАСОВАНИЕ/Designator (6 pins), U_Управл/Y_СОГЛАСОВАНИЕ/Designator (6 pins), U_Управл/Y_СОГЛАСОВАНИЕ/Designator (6 pins), U_РЕЛЕ (K1_U_РЕЛЕ#2.1 VD1_U_РЕЛЕ#2.1), U_РЕЛЕ (K1_U_РЕЛЕ#3.1 VD1_U_РЕЛЕ#3.1), U_РЕЛЕ (K1_U_РЕЛЕ#4.1 VD1_U_РЕЛЕ#4.1), U_РЕЛЕ (K1_U_РЕЛЕ#5.1 VD1_U_РЕЛЕ#5.1), U_РЕЛЕ (K1_U_РЕЛЕ#6.1 VD1_U_РЕЛЕ#6.1), U_РЕЛЕ (K1_U_РЕЛЕ#7.1 VD1_U_РЕЛЕ#7.1), U_РЕЛЕ (K1_U_РЕЛЕ#8.1 VD1_U_РЕЛЕ#8.1)
GND: U_РЕЛЕ (K1_U_РЕЛЕ#1.2 K1_U_РЕЛЕ#1.7 R14_U_РЕЛЕ#1.1 VT2_U_РЕЛЕ#1.2), МК (40 pins), U_Управл/Y_СОГЛАСОВАНИЕ/Designator (8 pins), U_Управл/Y_СОГЛАСОВАНИЕ/Designator (8 pins), U_Управл/Y_СОГЛАСОВАНИЕ/Designator (8 pins), U_Управл/Y_СОГЛАСОВАНИЕ/Designator (8 pins), U_Управл/Y_СОГЛАСОВАНИЕ/Designator (8 pins), U_Управл/Y_СОГЛАСОВАНИЕ/Designator (12 pins), U_РЕЛЕ (K1_U_РЕЛЕ#2.2 K1_U_РЕЛЕ#2.7 R14_U_РЕЛЕ#2.1 VT2_U_РЕЛЕ#2.2), U_РЕЛЕ (K1_U_РЕЛЕ#3.2 K1_U_РЕЛЕ#3.7 R14_U_РЕЛЕ#3.1 VT2_U_РЕЛЕ#3.2), U_РЕЛЕ (K1_U_РЕЛЕ#4.2 K1_U_РЕЛЕ#4.7 R14_U_РЕЛЕ#4.1 VT2_U_РЕЛЕ#4.2), U_РЕЛЕ (K1_U_РЕЛЕ#5.2 K1_U_РЕЛЕ#5.7 R14_U_РЕЛЕ#5.1 VT2_U_РЕЛЕ#5.2), U_РЕЛЕ (K1_U_РЕЛЕ#6.2 K1_U_РЕЛЕ#6.7 R14_U_РЕЛЕ#6.1 VT2_U_РЕЛЕ#6.2), U_РЕЛЕ (K1_U_РЕЛЕ#7.2 K1_U_РЕЛЕ#7.7 R14_U_РЕЛЕ#7.1 VT2_U_РЕЛЕ#7.2), U_РЕЛЕ (K1_U_РЕЛЕ#8.2 K1_U_РЕЛЕ#8.7 R14_U_РЕЛЕ#8.1 VT2_U_РЕЛЕ#8.2)
NetDD1_7: МК (DD1.7), U_Управл/Y_СОГЛАСОВАНИЕ/Designator (DD4_U_Управл_Y_СОГЛАСОВАНИЕ_Designator#5.12)
NetDD1_8: МК (DD1.8), U_Управл/Y_СОГЛАСОВАНИЕ/Designator (DD4_U_Управл_Y_СОГЛАСОВАНИЕ_Designator#5.15)
NetDD1_9: МК (DD1.9), U_Управл/Y_СОГЛАСОВАНИЕ/Designator (DD4_U_Управл_Y_СОГЛАСОВАНИЕ_Designator#6.2)
NetDD1_15: МК (DD1.15), U_Управл/Y_СОГЛАСОВАНИЕ/Designator (DD4_U_Управл_Y_СОГЛАСОВАНИЕ_Designator#3.10)
NetDD1_16: МК (DD1.16), U_Управл/Y_СОГЛАСОВАНИЕ/Designator (DD4_U_Управл_Y_СОГЛАСОВАНИЕ_Designator#3.12)
NetDD1_17: МК (DD1.17), U_Управл/Y_СОГЛАСОВАНИЕ/Designator (DD4_U_Управл_Y_СОГЛАСОВАНИЕ_Designator#3.15)
NetDD1_18: МК (DD1.18), U_Управл/Y_СОГЛАСОВАНИЕ/Designator (DD4_U_Управл_Y_СОГЛАСОВАНИЕ_Designator#4.2)
NetDD1_24: U_РЕЛЕ (R13_U_РЕЛЕ#1.1), МК (DD1.24)
NetDD1_25: МК (DD1.25), U_РЕЛЕ (R13_U_РЕЛЕ#2.1)
NetDD1_26: МК (DD1.26), U_РЕЛЕ (R13_U_РЕЛЕ#3.1)
NetDD1_29: МК (DD1.29), U_РЕЛЕ (R13_U_РЕЛЕ#4.1)
NetDD1_30: МК (DD1.30), U_РЕЛЕ (R13_U_РЕЛЕ#5.1)
NetDD1_31: МК (DD1.31), U_РЕЛЕ (R13_U_РЕЛЕ#6.1)
NetDD1_32: МК (DD1.32), U_РЕЛЕ (R13_U_РЕЛЕ#7.1)
NetDD1_33: МК (DD1.33), U_Управл/Y_СОГЛАСОВАНИЕ/Designator (DD4_U_Управл_Y_СОГЛАСОВАНИЕ_Designator#4.4)
NetDD1_34: МК (DD1.34), U_Управл/Y_СОГЛАСОВАНИЕ/Designator (DD4_U_Управл_Y_СОГЛАСОВАНИЕ_Designator#4.6)
NetDD1_36: МК (DD1.36), U_Управл/Y_СОГЛАСОВАНИЕ/Designator (DD4_U_Управл_Y_СОГЛАСОВАНИЕ_Designator#1.2)
NetDD1_37: МК (DD1.37), U_Управл/Y_СОГЛАСОВАНИЕ/Designator (DD4_U_Управл_Y_СОГЛАСОВАНИЕ_Designator#1.4)
NetDD1_47: МК (DD1.47), U_Управл/Y_СОГЛАСОВАНИЕ/Designator (DD4_U_Управл_Y_СОГЛАСОВАНИЕ_Designator#2.10)
NetDD1_48: МК (DD1.48), U_Управл/Y_СОГЛАСОВАНИЕ/Designator (DD4_U_Управл_Y_СОГЛАСОВАНИЕ_Designator#2.12)
NetDD1_51: МК (DD1.51), U_Управл/Y_СОГЛАСОВАНИЕ/Designator (DD4_U_Управл_Y_СОГЛАСОВАНИЕ_Designator#2.15)
NetDD1_52: МК (DD1.52), U_Управл/Y_СОГЛАСОВАНИЕ/Designator (DD4_U_Управл_Y_СОГЛАСОВАНИЕ_Designator#3.2)
NetDD1_53: МК (DD1.53), U_Управл/Y_СОГЛАСОВАНИЕ/Designator (DD4_U_Управл_Y_СОГЛАСОВАНИЕ_Designator#3.4)
NetDD1_54: МК (DD1.54), U_Управл/Y_СОГЛАСОВАНИЕ/Designator (DD4_U_Управл_Y_СОГЛАСОВАНИЕ_Designator#3.6)
NetDD1_63: МК (DD1.63), U_Управл/Y_СОГЛАСОВАНИЕ/Designator (DD4_U_Управл_Y_СОГЛАСОВАНИЕ_Designator#4.10)
NetDD1_64: МК (DD1.64), U_Управл/Y_СОГЛАСОВАНИЕ/Designator (DD4_U_Управл_Y_СОГЛАСОВАНИЕ_Designator#4.12)
NetDD1_65: МК (DD1.65), U_Управл/Y_СОГЛАСОВАНИЕ/Designator (DD4_U_Управл_Y_СОГЛАСОВАНИЕ_Designator#4.15)
NetDD1_66: МК (DD1.66), U_Управл/Y_СОГЛАСОВАНИЕ/Designator (DD4_U_Управл_Y_СОГЛАСОВАНИЕ_Designator#5.2)
NetDD1_67: МК (DD1.67), U_РЕЛЕ (R13_U_РЕЛЕ#8.1)
NetDD1_78: МК (DD1.78), U_Управл/Y_СОГЛАСОВАНИЕ/Designator (DD4_U_Управл_Y_СОГЛАСОВАНИЕ_Designator#5.4)
NetDD1_79: МК (DD1.79), U_Управл/Y_СОГЛАСОВАНИЕ/Designator (DD4_U_Управл_Y_СОГЛАСОВАНИЕ_Designator#5.6)
NetDD1_80: МК (DD1.80), U_Управл/Y_СОГЛАСОВАНИЕ/Designator (DD4_U_Управл_Y_СОГЛАСОВАНИЕ_Designator#5.10)
NetDD1_89: МК (DD1.89), U_Управл/Y_СОГЛАСОВАНИЕ/Designator (DD4_U_Управл_Y_СОГЛАСОВАНИЕ_Designator#1.6)
NetDD1_90: МК (DD1.90), U_Управл/Y_СОГЛАСОВАНИЕ/Designator (DD4_U_Управл_Y_СОГЛАСОВАНИЕ_Designator#1.10)
NetDD1_91: МК (DD1.91), U_Управл/Y_СОГЛАСОВАНИЕ/Designator (DD4_U_Управл_Y_СОГЛАСОВАНИЕ_Designator#1.12)
NetDD1_92: МК (DD1.92), U_Управл/Y_СОГЛАСОВАНИЕ/Designator (DD4_U_Управл_Y_СОГЛАСОВАНИЕ_Designator#1.15)
NetDD1_93: МК (DD1.93), U_Управл/Y_СОГЛАСОВАНИЕ/Designator (DD4_U_Управл_Y_СОГЛАСОВАНИЕ_Designator#2.2)
NetDD1_95: МК (DD1.95), U_Управл/Y_СОГЛАСОВАНИЕ/Designator (DD4_U_Управл_Y_СОГЛАСОВАНИЕ_Designator#2.4)
NetDD1_96: МК (DD1.96), U_Управл/Y_СОГЛАСОВАНИЕ/Designator (DD4_U_Управл_Y_СОГЛАСОВАНИЕ_Designator#2.6)
NetK1_U_РЕЛЕ#1_3: СОЕД (XH1.2), U_РЕЛЕ (K1_U_РЕЛЕ#1.3)
NetK1_U_РЕЛЕ#1_4: СОЕД (XH3.6), U_РЕЛЕ (K1_U_РЕЛЕ#1.4), U_РЕЛЕ (K1_U_РЕЛЕ#2.4), U_РЕЛЕ (K1_U_РЕЛЕ#3.4), U_РЕЛЕ (K1_U_РЕЛЕ#4.4), U_РЕЛЕ (K1_U_РЕЛЕ#5.4), U_РЕЛЕ (K1_U_РЕЛЕ#6.4), U_РЕЛЕ (K1_U_РЕЛЕ#7.4), U_РЕЛЕ (K1_U_РЕЛЕ#8.4)
NetK1_U_РЕЛЕ#1_5: СОЕД (XH3.5), U_РЕЛЕ (K1_U_РЕЛЕ#1.5), U_РЕЛЕ (K1_U_РЕЛЕ#2.5), U_РЕЛЕ (K1_U_РЕЛЕ#3.5), U_РЕЛЕ (K1_U_РЕЛЕ#4.5), U_РЕЛЕ (K1_U_РЕЛЕ#5.5), U_РЕЛЕ (K1_U_РЕЛЕ#6.5), U_РЕЛЕ (K1_U_РЕЛЕ#7.5), U_РЕЛЕ (K1_U_РЕЛЕ#8.5)
NetK1_U_РЕЛЕ#1_6: СОЕД (XH1.1), U_РЕЛЕ (K1_U_РЕЛЕ#1.6)
NetK1_U_РЕЛЕ#2_3: СОЕД (XH1.4), U_РЕЛЕ (K1_U_РЕЛЕ#2.3)
NetK1_U_РЕЛЕ#2_6: СОЕД (XH1.3), U_РЕЛЕ (K1_U_РЕЛЕ#2.6)
NetK1_U_РЕЛЕ#3_3: СОЕД (XH1.6), U_РЕЛЕ (K1_U_РЕЛЕ#3.3)
NetK1_U_РЕЛЕ#3_6: СОЕД (XH1.5), U_РЕЛЕ (K1_U_РЕЛЕ#3.6)
NetK1_U_РЕЛЕ#4_3: СОЕД (XH2.2), U_РЕЛЕ (K1_U_РЕЛЕ#4.3)
NetK1_U_РЕЛЕ#4_6: СОЕД (XH2.1), U_РЕЛЕ (K1_U_РЕЛЕ#4.6)
NetK1_U_РЕЛЕ#5_3: СОЕД (XH2.4), U_РЕЛЕ (K1_U_РЕЛЕ#5.3)
NetK1_U_РЕЛЕ#5_6: СОЕД (XH2.3), U_РЕЛЕ (K1_U_РЕЛЕ#5.6)
NetK1_U_РЕЛЕ#6_3: СОЕД (XH2.6), U_РЕЛЕ (K1_U_РЕЛЕ#6.3)
NetK1_U_РЕЛЕ#6_6: СОЕД (XH2.5), U_РЕЛЕ (K1_U_РЕЛЕ#6.6)
NetK1_U_РЕЛЕ#7_3: СОЕД (XH3.2), U_РЕЛЕ (K1_U_РЕЛЕ#7.3)
NetK1_U_РЕЛЕ#7_6: СОЕД (XH3.1), U_РЕЛЕ (K1_U_РЕЛЕ#7.6)
NetK1_U_РЕЛЕ#8_3: СОЕД (XH3.4), U_РЕЛЕ (K1_U_РЕЛЕ#8.3)
NetK1_U_РЕЛЕ#8_6: СОЕД (XH3.3), U_РЕЛЕ (K1_U_РЕЛЕ#8.6)
NetR15_U_Управл_Y_СОГЛАСОВАНИЕ_Designator#1_1: СОГЛАСОВАНИЕ с мюксами (XH11.1), U_Управл/Y_СОГЛАСОВАНИЕ/Designator (R15_U_Управл_Y_СОГЛАСОВАНИЕ_Designator#1.1)
NetR15_U_Управл_Y_СОГЛАСОВАНИЕ_Designator#2_1: СОГЛАСОВАНИЕ с мюксами (XH12.1), U_Управл/Y_СОГЛАСОВАНИЕ/Designator (R15_U_Управл_Y_СОГЛАСОВАНИЕ_Designator#2.1)
NetR15_U_Управл_Y_СОГЛАСОВАНИЕ_Designator#3_1: СОГЛАСОВАНИЕ с мюксами (XH13.1), U_Управл/Y_СОГЛАСОВАНИЕ/Designator (R15_U_Управл_Y_СОГЛАСОВАНИЕ_Designator#3.1)
NetR15_U_Управл_Y_СОГЛАСОВАНИЕ_Designator#4_1: СОГЛАСОВАНИЕ с мюксами (XH14.1), U_Управл/Y_СОГЛАСОВАНИЕ/Designator (R15_U_Управл_Y_СОГЛАСОВАНИЕ_Designator#4.1)
NetR15_U_Управл_Y_СОГЛАСОВАНИЕ_Designator#5_1: СОГЛАСОВАНИЕ с мюксами (XH15.1), U_Управл/Y_СОГЛАСОВАНИЕ/Designator (R15_U_Управл_Y_СОГЛАСОВАНИЕ_Designator#5.1)
NetR15_U_Управл_Y_СОГЛАСОВАНИЕ_Designator#6_1: СОГЛАСОВАНИЕ с мюксами (XH16.1), U_Управл/Y_СОГЛАСОВАНИЕ/Designator (R15_U_Управл_Y_СОГЛАСОВАНИЕ_Designator#6.1)
NetR16_U_Управл_Y_СОГЛАСОВАНИЕ_Designator#1_1: СОГЛАСОВАНИЕ с мюксами (XH11.2), U_Управл/Y_СОГЛАСОВАНИЕ/Designator (R16_U_Управл_Y_СОГЛАСОВАНИЕ_Designator#1.1)
NetR16_U_Управл_Y_СОГЛАСОВАНИЕ_Designator#2_1: СОГЛАСОВАНИЕ с мюксами (XH12.2), U_Управл/Y_СОГЛАСОВАНИЕ/Designator (R16_U_Управл_Y_СОГЛАСОВАНИЕ_Designator#2.1)
NetR16_U_Управл_Y_СОГЛАСОВАНИЕ_Designator#3_1: СОГЛАСОВАНИЕ с мюксами (XH13.2), U_Управл/Y_СОГЛАСОВАНИЕ/Designator (R16_U_Управл_Y_СОГЛАСОВАНИЕ_Designator#3.1)
NetR16_U_Управл_Y_СОГЛАСОВАНИЕ_Designator#4_1: СОГЛАСОВАНИЕ с мюксами (XH14.2), U_Управл/Y_СОГЛАСОВАНИЕ/Designator (R16_U_Управл_Y_СОГЛАСОВАНИЕ_Designator#4.1)
NetR16_U_Управл_Y_СОГЛАСОВАНИЕ_Designator#5_1: СОГЛАСОВАНИЕ с мюксами (XH15.2), U_Управл/Y_СОГЛАСОВАНИЕ/Designator (R16_U_Управл_Y_СОГЛАСОВАНИЕ_Designator#5.1)
NetR16_U_Управл_Y_СОГЛАСОВАНИЕ_Designator#6_1: СОГЛАСОВАНИЕ с мюксами (XH16.2), U_Управл/Y_СОГЛАСОВАНИЕ/Designator (R16_U_Управл_Y_СОГЛАСОВАНИЕ_Designator#6.1)
NetR17_U_Управл_Y_СОГЛАСОВАНИЕ_Designator#1_1: СОГЛАСОВАНИЕ с мюксами (XH11.3), U_Управл/Y_СОГЛАСОВАНИЕ/Designator (R17_U_Управл_Y_СОГЛАСОВАНИЕ_Designator#1.1)
NetR17_U_Управл_Y_СОГЛАСОВАНИЕ_Designator#2_1: СОГЛАСОВАНИЕ с мюксами (XH12.3), U_Управл/Y_СОГЛАСОВАНИЕ/Designator (R17_U_Управл_Y_СОГЛАСОВАНИЕ_Designator#2.1)
NetR17_U_Управл_Y_СОГЛАСОВАНИЕ_Designator#3_1: СОГЛАСОВАНИЕ с мюксами (XH13.3), U_Управл/Y_СОГЛАСОВАНИЕ/Designator (R17_U_Управл_Y_СОГЛАСОВАНИЕ_Designator#3.1)
NetR17_U_Управл_Y_СОГЛАСОВАНИЕ_Designator#4_1: СОГЛАСОВАНИЕ с мюксами (XH14.3), U_Управл/Y_СОГЛАСОВАНИЕ/Designator (R17_U_Управл_Y_СОГЛАСОВАНИЕ_Designator#4.1)
NetR17_U_Управл_Y_СОГЛАСОВАНИЕ_Designator#5_1: СОГЛАСОВАНИЕ с мюксами (XH15.3), U_Управл/Y_СОГЛАСОВАНИЕ/Designator (R17_U_Управл_Y_СОГЛАСОВАНИЕ_Designator#5.1)
NetR17_U_Управл_Y_СОГЛАСОВАНИЕ_Designator#6_1: СОГЛАСОВАНИЕ с мюксами (XH16.3), U_Управл/Y_СОГЛАСОВАНИЕ/Designator (R17_U_Управл_Y_СОГЛАСОВАНИЕ_Designator#6.1)
NetR18_U_Управл_Y_СОГЛАСОВАНИЕ_Designator#1_1: СОГЛАСОВАНИЕ с мюксами (XH11.4), U_Управл/Y_СОГЛАСОВАНИЕ/Designator (R18_U_Управл_Y_СОГЛАСОВАНИЕ_Designator#1.1)
NetR18_U_Управл_Y_СОГЛАСОВАНИЕ_Designator#2_1: СОГЛАСОВАНИЕ с мюксами (XH12.4), U_Управл/Y_СОГЛАСОВАНИЕ/Designator (R18_U_Управл_Y_СОГЛАСОВАНИЕ_Designator#2.1)
NetR18_U_Управл_Y_СОГЛАСОВАНИЕ_Designator#3_1: СОГЛАСОВАНИЕ с мюксами (XH13.4), U_Управл/Y_СОГЛАСОВАНИЕ/Designator (R18_U_Управл_Y_СОГЛАСОВАНИЕ_Designator#3.1)
NetR18_U_Управл_Y_СОГЛАСОВАНИЕ_Designator#4_1: СОГЛАСОВАНИЕ с мюксами (XH14.4), U_Управл/Y_СОГЛАСОВАНИЕ/Designator (R18_U_Управл_Y_СОГЛАСОВАНИЕ_Designator#4.1)
NetR18_U_Управл_Y_СОГЛАСОВАНИЕ_Designator#5_1: СОГЛАСОВАНИЕ с мюксами (XH15.4), U_Управл/Y_СОГЛАСОВАНИЕ/Designator (R18_U_Управл_Y_СОГЛАСОВАНИЕ_Designator#5.1)
NetR18_U_Управл_Y_СОГЛАСОВАНИЕ_Designator#6_1: СОГЛАСОВАНИЕ с мюксами (XH16.4), U_Управл/Y_СОГЛАСОВАНИЕ/Designator (R18_U_Управл_Y_СОГЛАСОВАНИЕ_Designator#6.1)
NetR19_U_Управл_Y_СОГЛАСОВАНИЕ_Designator#1_1: СОГЛАСОВАНИЕ с мюксами (XH11.5), U_Управл/Y_СОГЛАСОВАНИЕ/Designator (R19_U_Управл_Y_СОГЛАСОВАНИЕ_Designator#1.1)
NetR19_U_Управл_Y_СОГЛАСОВАНИЕ_Designator#2_1: СОГЛАСОВАНИЕ с мюксами (XH12.5), U_Управл/Y_СОГЛАСОВАНИЕ/Designator (R19_U_Управл_Y_СОГЛАСОВАНИЕ_Designator#2.1)
NetR19_U_Управл_Y_СОГЛАСОВАНИЕ_Designator#3_1: СОГЛАСОВАНИЕ с мюксами (XH13.5), U_Управл/Y_СОГЛАСОВАНИЕ/Designator (R19_U_Управл_Y_СОГЛАСОВАНИЕ_Designator#3.1)
NetR19_U_Управл_Y_СОГЛАСОВАНИЕ_Designator#4_1: СОГЛАСОВАНИЕ с мюксами (XH14.5), U_Управл/Y_СОГЛАСОВАНИЕ/Designator (R19_U_Управл_Y_СОГЛАСОВАНИЕ_Designator#4.1)
NetR19_U_Управл_Y_СОГЛАСОВАНИЕ_Designator#5_1: СОГЛАСОВАНИЕ с мюксами (XH15.5), U_Управл/Y_СОГЛАСОВАНИЕ/Designator (R19_U_Управл_Y_СОГЛАСОВАНИЕ_Designator#5.1)
NetR20_U_Управл_Y_СОГЛАСОВАНИЕ_Designator#1_1: СОГЛАСОВАНИЕ с мюксами (XH11.6), U_Управл/Y_СОГЛАСОВАНИЕ/Designator (R20_U_Управл_Y_СОГЛАСОВАНИЕ_Designator#1.1)
NetR20_U_Управл_Y_СОГЛАСОВАНИЕ_Designator#2_1: СОГЛАСОВАНИЕ с мюксами (XH12.6), U_Управл/Y_СОГЛАСОВАНИЕ/Designator (R20_U_Управл_Y_СОГЛАСОВАНИЕ_Designator#2.1)
NetR20_U_Управл_Y_СОГЛАСОВАНИЕ_Designator#3_1: СОГЛАСОВАНИЕ с мюксами (XH13.6), U_Управл/Y_СОГЛАСОВАНИЕ/Designator (R20_U_Управл_Y_СОГЛАСОВАНИЕ_Designator#3.1)
NetR20_U_Управл_Y_СОГЛАСОВАНИЕ_Designator#4_1: СОГЛАСОВАНИЕ с мюксами (XH14.6), U_Управл/Y_СОГЛАСОВАНИЕ/Designator (R20_U_Управл_Y_СОГЛАСОВАНИЕ_Designator#4.1)
NetR20_U_Управл_Y_СОГЛАСОВАНИЕ_Designator#5_1: СОГЛАСОВАНИЕ с мюксами (XH15.6), U_Управл/Y_СОГЛАСОВАНИЕ/Designator (R20_U_Управл_Y_СОГЛАСОВАНИЕ_Designator#5.1)
ZD1: МК (DD1.81), U_Управл/Y_СОГЛАСОВАНИЕ/Designator (DD4_U_Управл_Y_СОГЛАСОВАНИЕ_Designator#6.4)
ZD2: МК (DD1.82), U_Управл/Y_СОГЛАСОВАНИЕ/Designator (DD4_U_Управл_Y_СОГЛАСОВАНИЕ_Designator#6.6)
ZD3: МК (DD1.83), U_Управл/Y_СОГЛАСОВАНИЕ/Designator (DD4_U_Управл_Y_СОГЛАСОВАНИЕ_Designator#6.10)